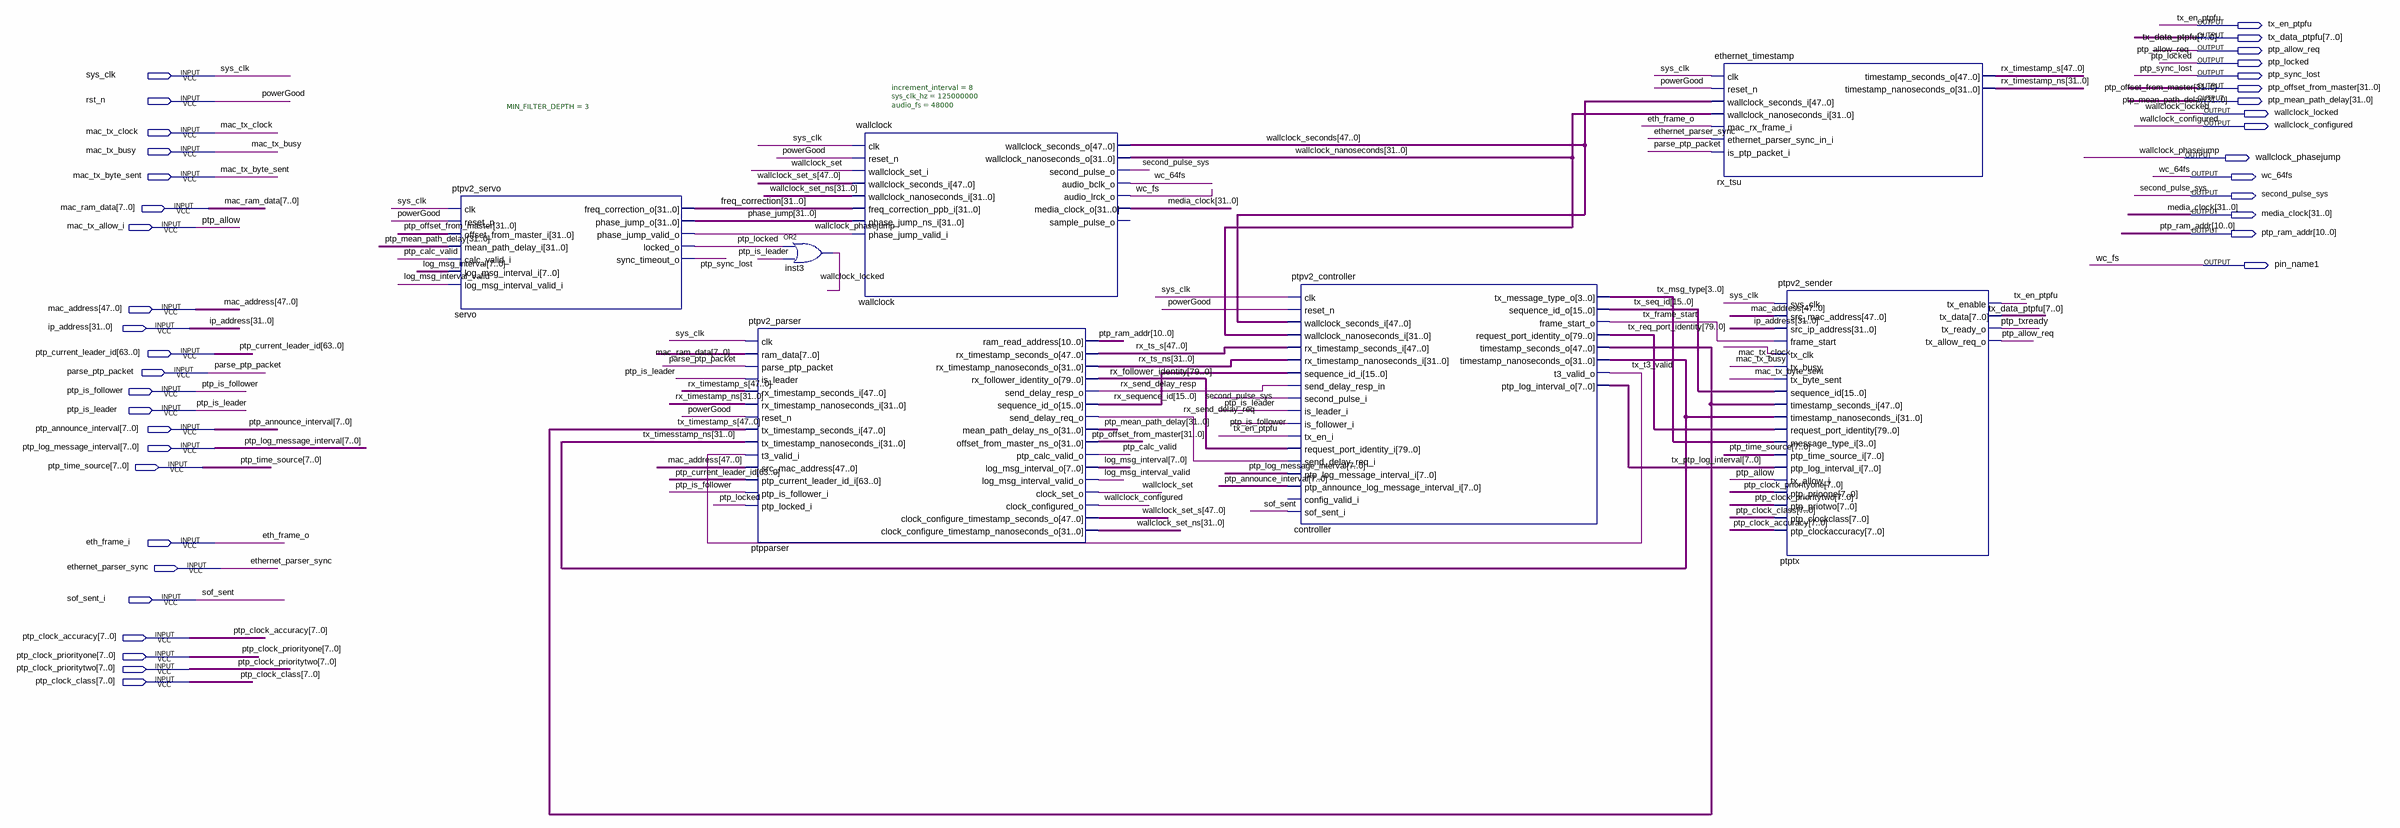
[diagram p0: schematic sheet]
// Quartus schematic ptp_module.bdf as structural Verilog: 7 symbols, 38 pins
module ptp_module (
  input  sys_clk,
  input  rst_n,
  input  mac_tx_clock,
  input  mac_tx_busy,
  input  mac_tx_byte_sent,
  input  [7:0] mac_ram_data,
  input  mac_tx_allow_i,
  input  [47:0] mac_address,
  input  [31:0] ip_address,
  input  [63:0] ptp_current_leader_id,
  input  parse_ptp_packet,
  input  ptp_is_follower,
  input  ptp_is_leader,
  input  [7:0] ptp_announce_interval,
  input  [7:0] ptp_log_message_interval,
  input  [7:0] ptp_time_source,
  input  eth_frame_i,
  input  ethernet_parser_sync,
  input  sof_sent_i,
  input  [7:0] ptp_clock_accuracy,
  input  [7:0] ptp_clock_priorityone,
  input  [7:0] ptp_clock_prioritytwo,
  input  [7:0] ptp_clock_class,
  output tx_en_ptpfu,
  output [7:0] tx_data_ptpfu,
  output ptp_allow_req,
  output ptp_locked,
  output ptp_sync_lost,
  output [31:0] ptp_offset_from_master,
  output [31:0] ptp_mean_path_delay,
  output wallclock_locked,
  output wallclock_configured,
  output wallclock_phasejump,
  output wc_64fs,
  output second_pulse_sys,
  output [31:0] media_clock,
  output [10:0] ptp_ram_addr,
  output pin_name1
);

  wire log_msg_interval_valid, ptp_calc_valid, ptp_txready, rx_send_delay_req, rx_send_delay_resp,
       tx_frame_start, tx_t3_valid, wallclock_set;
  wire [3:0] tx_msg_type;
  wire [7:0] log_msg_interval, tx_ptp_log_interval;
  wire [15:0] rx_sequence_id, tx_seq_id;
  wire [31:0] freq_correction, phase_jump, rx_timestamp_ns, rx_ts_ns, tx_timesstamp_ns,
       wallclock_nanoseconds, wallclock_set_ns;
  wire [47:0] rx_timestamp_s, rx_ts_s, tx_timestamp_s, wallclock_seconds, wallclock_set_s;
  wire [79:0] rx_follower_identity, tx_req_port_identity;

  ptpv2_servo servo (
    .clk(sys_clk), .reset_n(rst_n), .offset_from_master_i(ptp_offset_from_master),
    .mean_path_delay_i(ptp_mean_path_delay), .calc_valid_i(ptp_calc_valid),
    .log_msg_interval_i(log_msg_interval), .log_msg_interval_valid_i(log_msg_interval_valid),
    .freq_correction_o(freq_correction), .phase_jump_o(phase_jump), .phase_jump_valid_o(wallclock_phasejump),
    .locked_o(ptp_locked), .sync_timeout_o(ptp_sync_lost));
  or inst3 (wallclock_locked, ptp_locked, ptp_is_leader);
  ptpv2_parser #(.MIN_FILTER_DEPTH(3)) ptpparser (
    .clk(sys_clk), .ram_data(mac_ram_data), .parse_ptp_packet(parse_ptp_packet), .is_leader(ptp_is_leader),
    .rx_timestamp_seconds_i(rx_timestamp_s), .rx_timestamp_nanoseconds_i(rx_timestamp_ns), .reset_n(rst_n),
    .tx_timestamp_seconds_i(tx_timestamp_s), .tx_timestamp_nanoseconds_i(tx_timesstamp_ns),
    .t3_valid_i(tx_t3_valid), .src_mac_address(mac_address), .ptp_current_leader_id_i(ptp_current_leader_id),
    .ptp_is_follower_i(ptp_is_follower), .ptp_locked_i(ptp_locked), .ram_read_address(ptp_ram_addr),
    .rx_timestamp_seconds_o(rx_ts_s), .rx_timestamp_nanoseconds_o(rx_ts_ns),
    .rx_follower_identity_o(rx_follower_identity), .send_delay_resp_o(rx_send_delay_resp),
    .sequence_id_o(rx_sequence_id), .send_delay_req_o(rx_send_delay_req),
    .mean_path_delay_ns_o(ptp_mean_path_delay), .offset_from_master_ns_o(ptp_offset_from_master),
    .ptp_calc_valid_o(ptp_calc_valid), .log_msg_interval_o(log_msg_interval),
    .log_msg_interval_valid_o(log_msg_interval_valid), .clock_set_o(wallclock_set),
    .clock_configured_o(wallclock_configured), .clock_configure_timestamp_seconds_o(wallclock_set_s),
    .clock_configure_timestamp_nanoseconds_o(wallclock_set_ns));
  wallclock #(.increment_interval(8), .sys_clk_hz(125000000), .audio_fs(48000)) wallclock (
    .clk(sys_clk), .reset_n(rst_n), .wallclock_set_i(wallclock_set), .wallclock_seconds_i(wallclock_set_s),
    .wallclock_nanoseconds_i(wallclock_set_ns), .freq_correction_ppb_i(freq_correction),
    .phase_jump_ns_i(phase_jump), .phase_jump_valid_i(wallclock_phasejump),
    .wallclock_seconds_o(wallclock_seconds), .wallclock_nanoseconds_o(wallclock_nanoseconds),
    .second_pulse_o(second_pulse_sys), .audio_bclk_o(wc_64fs), .audio_lrck_o(pin_name1),
    .media_clock_o(media_clock));  // open: sample_pulse_o
  ptpv2_controller controller (
    .clk(sys_clk), .reset_n(rst_n), .wallclock_seconds_i(wallclock_seconds),
    .wallclock_nanoseconds_i(wallclock_nanoseconds), .rx_timestamp_seconds_i(rx_ts_s),
    .rx_timestamp_nanoseconds_i(rx_ts_ns), .sequence_id_i(rx_sequence_id),
    .send_delay_resp_in(rx_send_delay_resp), .second_pulse_i(second_pulse_sys), .is_leader_i(ptp_is_leader),
    .is_follower_i(ptp_is_follower), .tx_en_i(tx_en_ptpfu), .request_port_identity_i(rx_follower_identity),
    .send_delay_req_i(rx_send_delay_req), .ptp_log_message_interval_i(ptp_log_message_interval),
    .ptp_announce_log_message_interval_i(ptp_announce_interval), .sof_sent_i(sof_sent_i),
    .tx_message_type_o(tx_msg_type), .sequence_id_o(tx_seq_id), .frame_start_o(tx_frame_start),
    .request_port_identity_o(tx_req_port_identity), .timestamp_seconds_o(tx_timestamp_s),
    .timestamp_nanoseconds_o(tx_timesstamp_ns), .t3_valid_o(tx_t3_valid),
    .ptp_log_interval_o(tx_ptp_log_interval));  // open: config_valid_i
  ethernet_timestamp rx_tsu (
    .clk(sys_clk), .reset_n(rst_n), .wallclock_seconds_i(wallclock_seconds),
    .wallclock_nanoseconds_i(wallclock_nanoseconds), .mac_rx_frame_i(eth_frame_i),
    .ethernet_parser_sync_in_i(ethernet_parser_sync), .is_ptp_packet_i(parse_ptp_packet),
    .timestamp_seconds_o(rx_timestamp_s), .timestamp_nanoseconds_o(rx_timestamp_ns));
  ptpv2_sender ptptx (
    .sys_clk(sys_clk), .src_mac_address(mac_address), .src_ip_address(ip_address),
    .frame_start(tx_frame_start), .tx_clk(mac_tx_clock), .tx_busy(mac_tx_busy),
    .tx_byte_sent(mac_tx_byte_sent), .sequence_id(tx_seq_id), .timestamp_seconds_i(tx_timestamp_s),
    .timestamp_nanoseconds_i(tx_timesstamp_ns), .request_port_identity(tx_req_port_identity),
    .message_type_i(tx_msg_type), .ptp_time_source_i(ptp_time_source),
    .ptp_log_interval_i(tx_ptp_log_interval), .tx_allow_i(mac_tx_allow_i),
    .ptp_prioone(ptp_clock_priorityone), .ptp_priotwo(ptp_clock_prioritytwo),
    .ptp_clockclass(ptp_clock_class), .ptp_clockaccuracy(ptp_clock_accuracy), .tx_enable(tx_en_ptpfu),
    .tx_data(tx_data_ptpfu), .tx_ready_o(ptp_txready), .tx_allow_req_o(ptp_allow_req));

  // Other names for the same wires on the sheet: eth_frame_o = eth_frame_i; powerGood = rst_n;
  //   ptp_allow = mac_tx_allow_i; sof_sent = sof_sent_i; wc_fs = pin_name1
endmodule
